# EAGLE schematic Bidirectional Logic Converter (EAGLE 6.1)
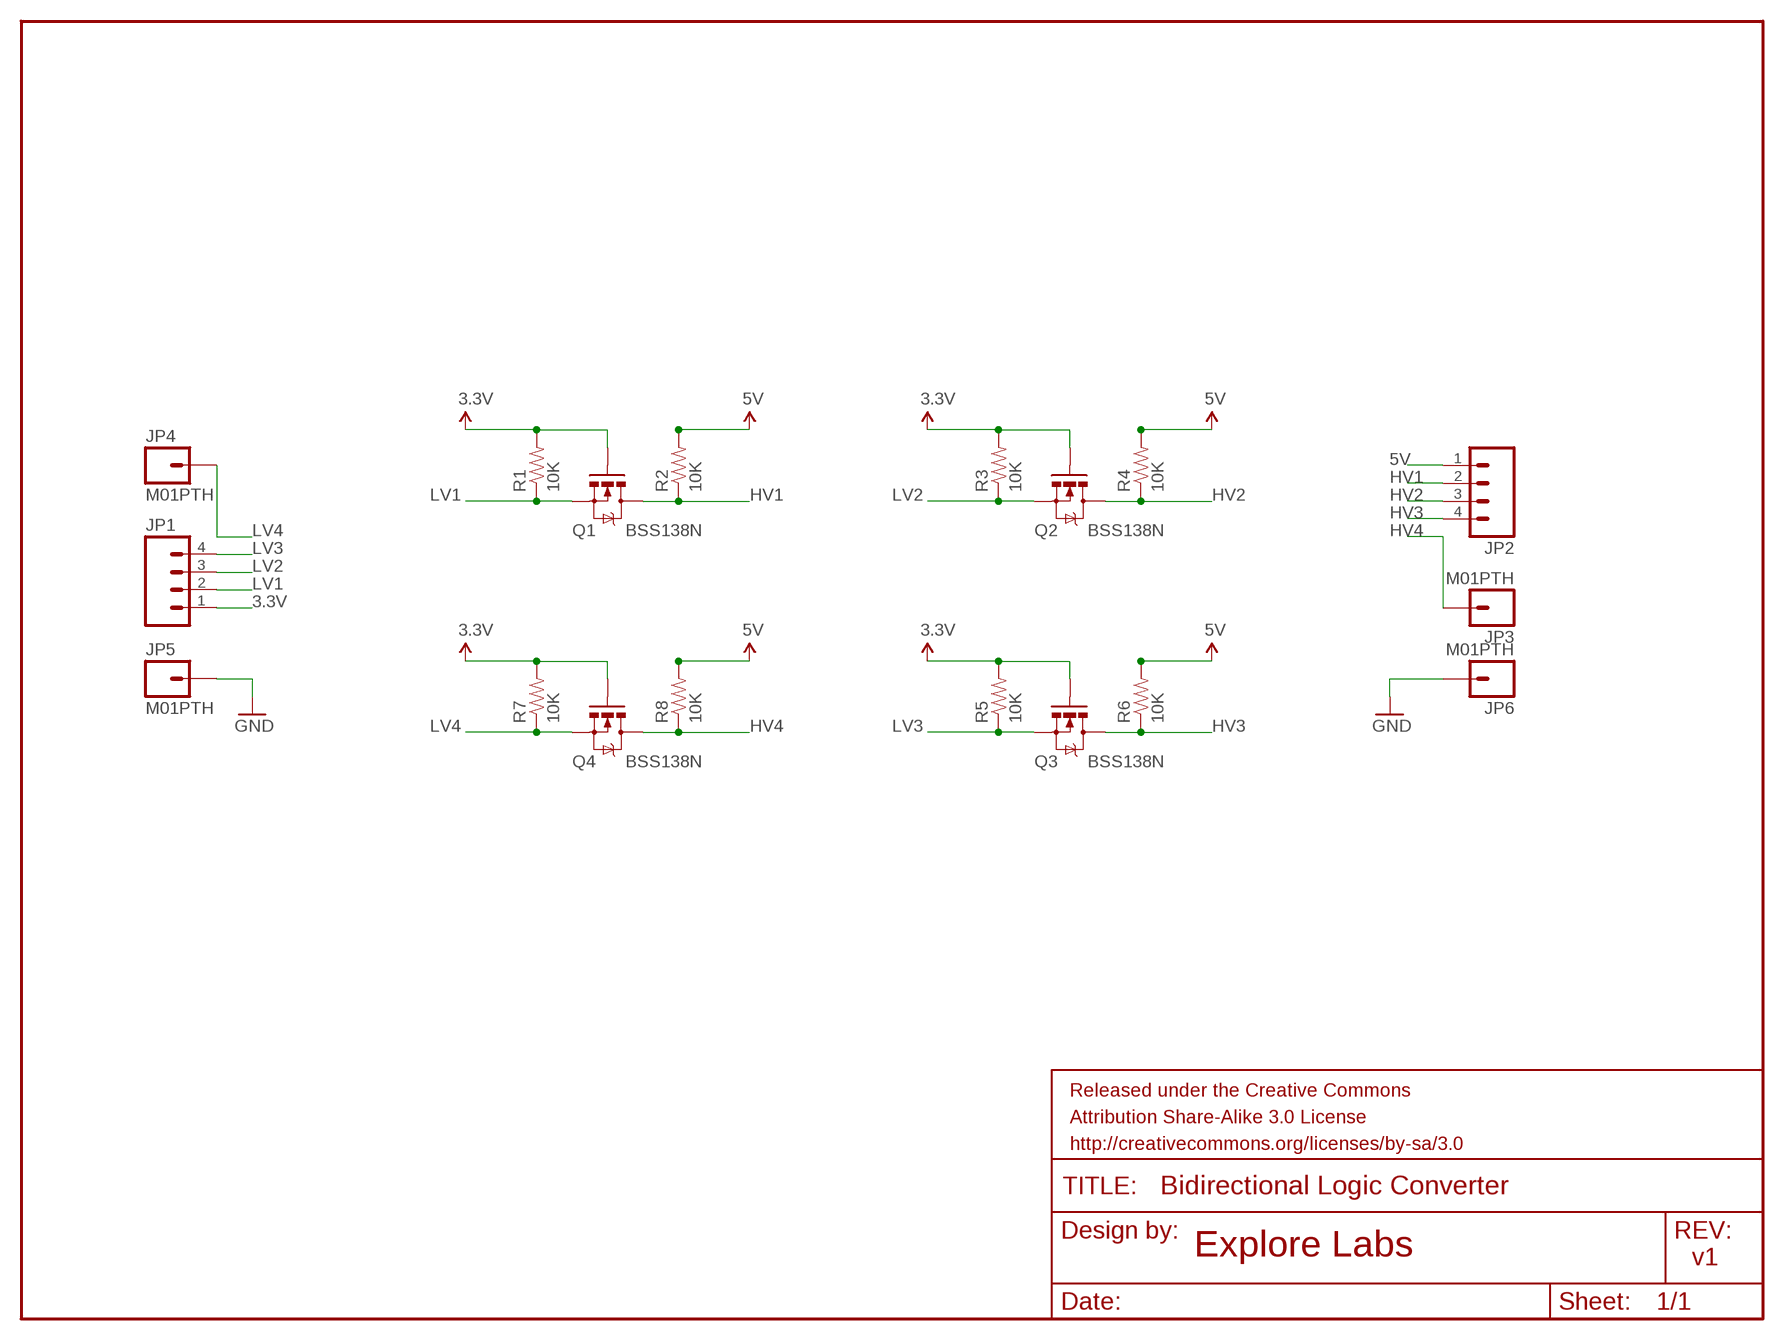
[diagram p0: schematic, sheet 1]

## Parts
JP1  M04PTH  [1X04]
JP2  M04PTH  [1X04]
JP3  M01PTH  [1X01]
JP4  M01PTH  [1X01]
JP5  M01PTH  [1X01]
JP6  M01PTH  [1X01]
Q1  BSS138N  MOSFET-NCHANNELSMD  [SOT23-3]
Q2  BSS138N  MOSFET-NCHANNELSMD  [SOT23-3]
Q3  BSS138N  MOSFET-NCHANNELSMD  [SOT23-3]
Q4  BSS138N  MOSFET-NCHANNELSMD  [SOT23-3]
R1  10K  RESISTOR0603-RES  [0603-RES]
R2  10K  RESISTOR0603-RES  [0603-RES]
R3  10K  RESISTOR0603-RES  [0603-RES]
R4  10K  RESISTOR0603-RES  [0603-RES]
R5  10K  RESISTOR0603-RES  [0603-RES]
R6  10K  RESISTOR0603-RES  [0603-RES]
R7  10K  RESISTOR0603-RES  [0603-RES]
R8  10K  RESISTOR0603-RES  [0603-RES]

## Nets
3.3V: JP1.1 Q1.1(G) Q2.1(G) Q3.1(G) Q4.1(G) R1.2 R3.2 R5.2 R7.2
5V: JP2.1 R2.2 R4.2 R6.2 R8.2
GND: JP5.1 JP6.1
HV1: JP2.2 Q1.3(D) R2.1
HV2: JP2.3 Q2.3(D) R4.1
HV3: JP2.4 Q3.3(D) R6.1
HV4: JP3.1 Q4.3(D) R8.1
LV1: JP1.2 Q1.2(S) R1.1
LV2: JP1.3 Q2.2(S) R3.1
LV3: JP1.4 Q3.2(S) R5.1
LV4: JP4.1 Q4.2(S) R7.1

## Notes on the sheet
- Explore Labs
- v1

## Library data of the parts
JP1 JP2 = SparkFun-Connectors:M04: Header 4 Standard 4-pin 0.1" header. Use with straight break away headers (SKU : PRT-00116), right angle break away headers (PRT-00553), swiss pins (PRT-00743), machine pins (PRT-00117), and female headers (PRT-00115). Molex polarized connector foot print use with SKU : PRT-08231 with associated crimp pins and housings. 1MM SMD Version SKU: PRT-10208
JP3-JP6 = SparkFun-Connectors:M01: Header 1 Standard 1-pin 0.1" header. Use with straight break away headers (SKU : PRT-00116), right angle break away headers (PRT-00553), swiss pins (PRT-00743), machine pins (PRT-00117), and female headers (PRT-00115).
Q1-Q4 = SparkFun-DiscreteSemi:MOSFET-NCHANNEL: Generic NMOS footprint
R1-R8 = SparkFun-Passives:RESISTOR: Resistor Basic schematic elements and footprints for 0603, 1206, and PTH resistors.